# Altium schematic sheet Ethernet Cable Tester.SchDoc
size A; SheetNumber: 9; SheetTotal: 9
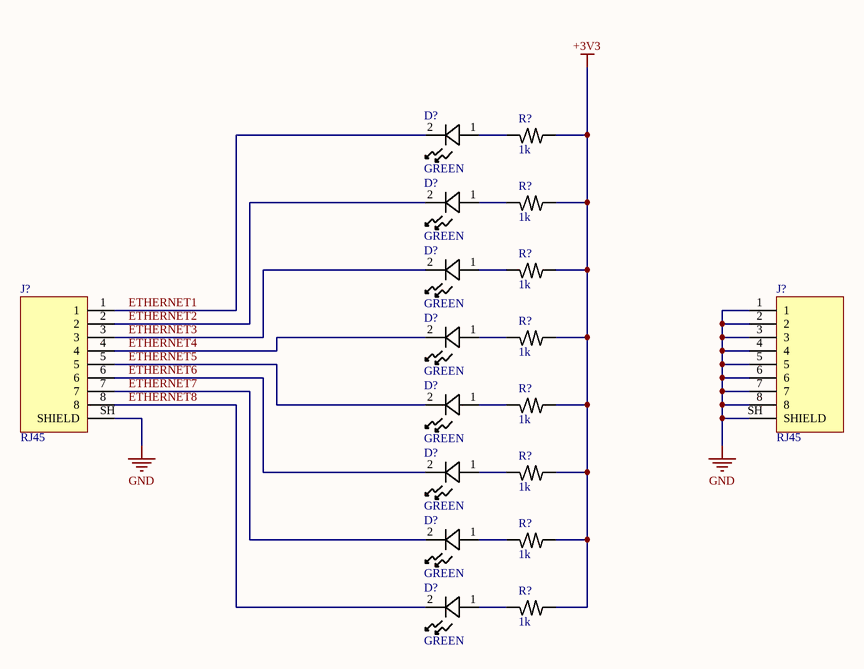
[diagram p0: Ethernet Cable Tester.SchDoc]

## Parts
(Parts that share a designator on the sheet are numbered #1, #2 ... from top to bottom, then left to right.)
D?#1  GREEN  [LED0805 GREEN]
D?#2  GREEN  [LED0805 GREEN]
D?#3  GREEN  [LED0805 GREEN]
D?#4  GREEN  [LED0805 GREEN]
D?#5  GREEN  [LED0805 GREEN]
D?#6  GREEN  [LED0805 GREEN]
D?#7  GREEN  [LED0805 GREEN]
D?#8  GREEN  [LED0805 GREEN]
J?#1  RJ45  [RJ45 Shielded No LED]
J?#2  RJ45  [RJ45 Shielded No LED]
R?#1  1k  [R0603]
R?#2  1k  [R0603]
R?#3  1k  [R0603]
R?#4  1k  [R0603]
R?#5  1k  [R0603]
R?#6  1k  [R0603]
R?#7  1k  [R0603]
R?#8  1k  [R0603]

## Nets
+3V3: R?#1.1 R?#2.1 R?#3.1 R?#4.1 R?#5.1 R?#6.1 R?#7.1 R?#8.1
GND: J?#1.SH(SHIELD) J?#2.1 J?#2.2 J?#2.3 J?#2.4 J?#2.5 J?#2.6 J?#2.7 J?#2.8 J?#2.SH(SHIELD)
ETHERNET1: D?#1.2 J?#1.1
ETHERNET2: D?#2.2 J?#1.2
ETHERNET3: D?#3.2 J?#1.3
ETHERNET4: D?#4.2 J?#1.4
ETHERNET5: D?#5.2 J?#1.5
ETHERNET6: D?#6.2 J?#1.6
ETHERNET7: D?#7.2 J?#1.7
ETHERNET8: D?#8.2 J?#1.8
NetD?#1_1: D?#1.1 R?#1.2
NetD?#2_1: D?#2.1 R?#2.2
NetD?#3_1: D?#3.1 R?#3.2
NetD?#4_1: D?#4.1 R?#4.2
NetD?#5_1: D?#5.1 R?#5.2
NetD?#6_1: D?#6.1 R?#6.2
NetD?#7_1: D?#7.1 R?#7.2
NetD?#8_1: D?#8.1 R?#8.2

## Notes on the sheet
- Project:
- Sheet Title:
- Size
- Date:
- A
- Sheet Number:
- Sheet Total:
- Revision:
- Time:
- Author:

## Library data of the parts
D?#1-D?#8 = LED: LED EMERALD GREEN WATER CLEAR 0805 SMD; MF: XINGLIGHT; MP: XL-TD2012UGC; ComponentLink1Description: Datasheet; ComponentLink1URL: https://www.lcsc.com/datasheet/C5349942.pdf; ComponentLink2Description: Supplier1; ComponentLink2URL: https://www.lcsc.com/product-detail/C5349942.html
J?#1 J?#2 = RJ45 Shielded No LED: CONN MOD JACK RJ45 TH R/A SHIELDED; MF: Hong Cheng; MP: HC-WK88-H18-K; ComponentLink1Description: Datasheet; ComponentLink1URL: https://www.lcsc.com/datasheet/C7501837.pdf; ComponentLink2Description: Supplier1; ComponentLink2URL: https://www.lcsc.com/product-detail/C7501837.html
R?#1-R?#8 = Res: RES 1kΩ ±5% 100mW 0603; MF: VO; MP: SCR0603J1K; ComponentLink1Description: Datasheet; ComponentLink1URL: https://www.lcsc.com/datasheet/C3017736.pdf; ComponentLink2Description: Supplier1; ComponentLink2URL: https://www.lcsc.com/product-detail/C3017736.html